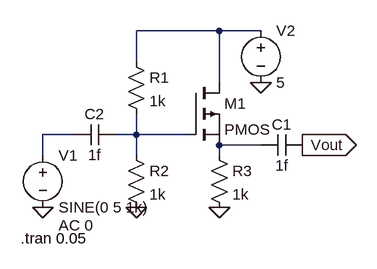
[diagram p0: schematic (3a) source follower.asc]
(3a) source follower.asc, the LTspice schematic file:
Version 4
SHEET 1 880 680
WIRE 272 32 144 32
WIRE 336 32 272 32
WIRE 144 80 144 32
WIRE 272 112 272 32
WIRE 48 192 0 192
WIRE 144 192 144 160
WIRE 144 192 112 192
WIRE 224 192 144 192
WIRE 336 208 272 208
WIRE 0 224 0 192
WIRE 144 224 144 192
WIRE 272 224 272 208
FLAG 144 304 0
FLAG 272 304 0
FLAG 0 304 0
FLAG 400 208 Vout
IOPIN 400 208 Out
FLAG 336 112 0
SYMBOL pmos 224 112 R0
SYMATTR InstName M1
SYMBOL res 128 64 R0
SYMATTR InstName R1
SYMATTR Value 1k
SYMBOL res 128 208 R0
SYMATTR InstName R2
SYMATTR Value 1k
SYMBOL res 256 208 R0
SYMATTR InstName R3
SYMATTR Value 1k
SYMBOL voltage 0 208 R0
WINDOW 123 24 124 Left 2
WINDOW 39 0 0 Left 0
SYMATTR InstName V1
SYMATTR Value SINE(0 5 1k)
SYMATTR Value2 AC 0
SYMBOL cap 400 192 R90
WINDOW 0 0 32 VBottom 2
WINDOW 3 32 32 VTop 2
SYMATTR InstName C1
SYMATTR Value 1f
SYMBOL cap 112 176 R90
WINDOW 0 0 32 VBottom 2
WINDOW 3 32 32 VTop 2
SYMATTR InstName C2
SYMATTR Value 1f
SYMBOL voltage 336 16 R0
WINDOW 123 0 0 Left 0
WINDOW 39 0 0 Left 0
SYMATTR InstName V2
SYMATTR Value 5
TEXT -34 352 Left 2 !.tran 0.05

The netlist it stands for:
* (3a) source follower.asc
M1 N001 N003 N004 N004 PMOS
R1 N001 N003 1k
R2 N003 0 1k
R3 N004 0 1k
V1 N002 0 SINE(0 5 1k) AC 0
C1 Vout N004 1f
C2 N003 N002 1f
V2 N001 0 5
.model NMOS NMOS
.model PMOS PMOS
.lib standard.mos
.tran 0.05
.backanno
.end